# Altium project UD-CPU_DIN_faceboard.PrjPcb
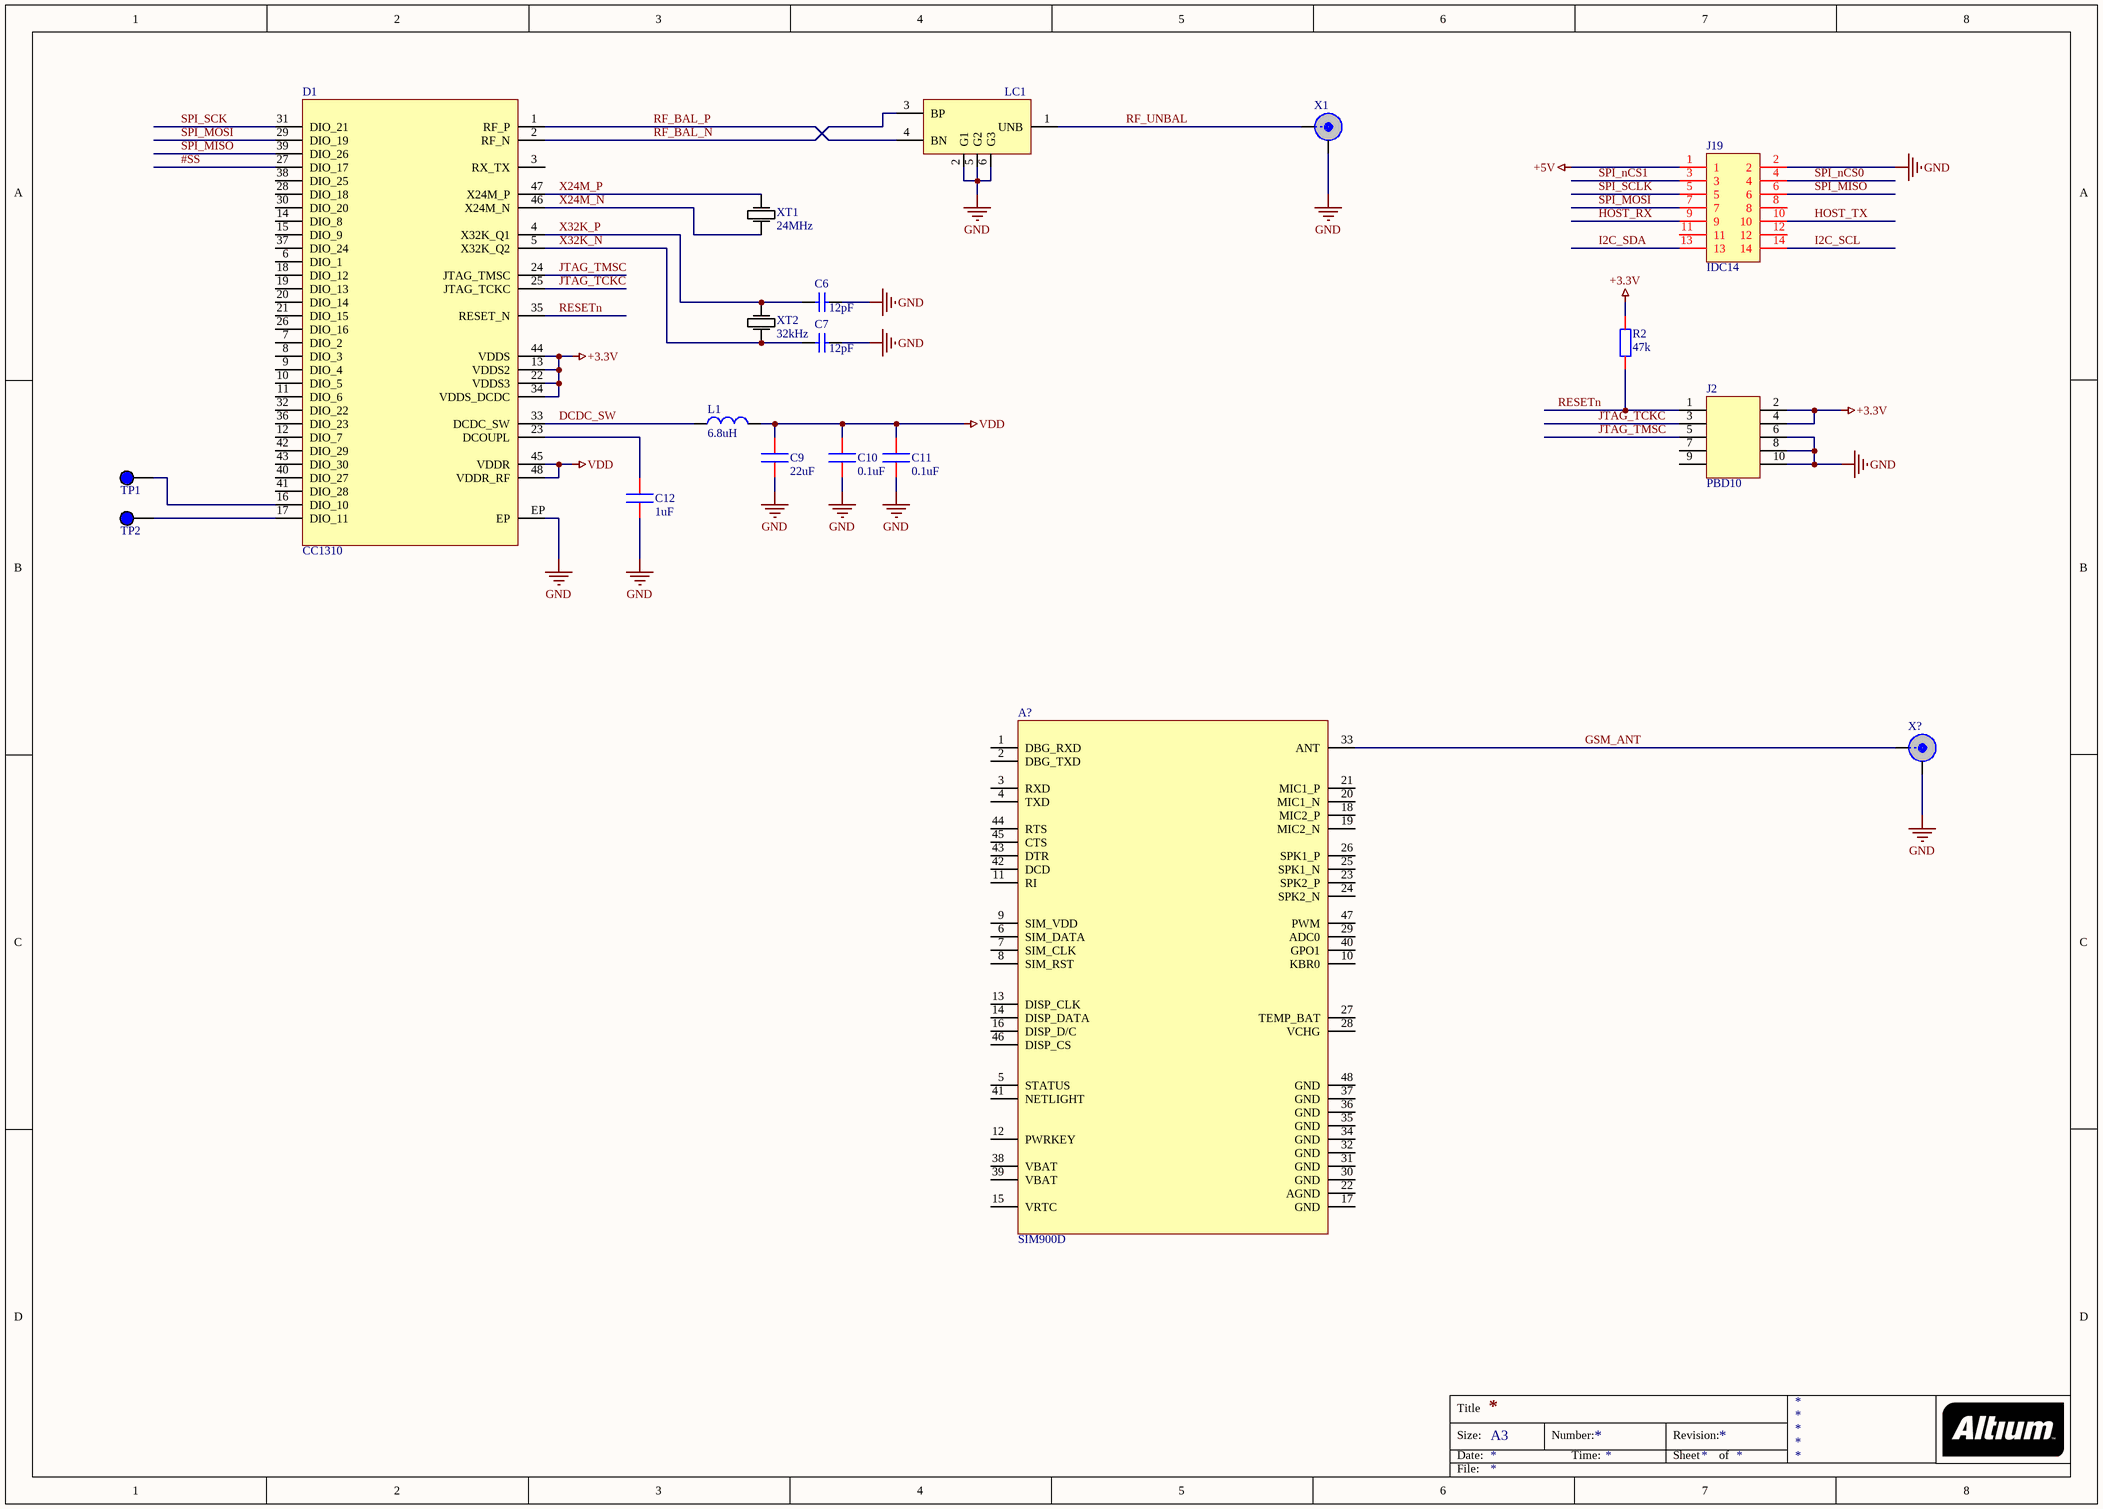
[diagram p0: CPU_DIN_faceboard.SchDoc]
1 sheet, 19 parts. Net scope: global (net labels, ports and power ports of the same name join across sheets).
Board file: CPU_DIN_faceboard_v1_0.PcbDoc

## Sheet CPU_DIN_faceboard.SchDoc
size A3

### Parts
A?  SIM900D  [sim900d]
C6  12pF  [C0603]
C7  12pF  [C0603]
C9  22uF  [C1210]
C10  0.1uF  [C0603]
C11  0.1uF  [C0603]
C12  1uF  [C0603]
D1  CC1310  [TI_RGZ-48]
J2  PBD10  [PBD-10]
J19  IDC14  [IDC14]
L1  6.8uH  [L0603]
LC1  RF_BALUN  [Balun_0433BM15A0001]  (value not drawn)
R2  47k  [R0603]
TP1  TESTPOINT  [testpad]  (value not drawn)
TP2  TESTPOINT  [testpad]  (value not drawn)
X1  SMA coax. connector  [SMA-jr]  (value not drawn)
X?  SMA coax. connector  [SMA-jr]  (value not drawn)
XT1  24MHz  [HC-49U/S]
XT2  32kHz  [XTAL_d2x6mm]

### Nets
+3.3V: D1.13(VDDS2) D1.22(VDDS3) D1.34(VDDS_DCDC) D1.44(VDDS) J2.2 J2.4 R2.2
+5V: J19.1
GND: C6.2 C7.2 C9.1 C10.1 C11.1 C12.2 D1.EP J2.6 J2.8 J2.10 J19.2 LC1.2(G1) LC1.5(G2) LC1.6(G3) X1.SH X?.SH
VDD: C9.2 C10.2 C11.2 D1.45(VDDR) D1.48(VDDR_RF) L1.2
#SS: D1.27(DIO_17)
DCDC_SW: D1.33(DCDC_SW) L1.1
GSM_ANT: A?.33(ANT) X?.I
HOST_RX: J19.9
HOST_TX: J19.10
I2C_SCL: J19.14
I2C_SDA: J19.13
JTAG_TCKC: D1.25(JTAG_TCKC) J2.3
JTAG_TMSC: D1.24(JTAG_TMSC) J2.5
RESETn: D1.35(RESET_N) J2.1 R2.1
RF_BAL_N: D1.2(RF_N) LC1.3(BP)
RF_BAL_P: D1.1(RF_P) LC1.4(BN)
RF_UNBAL: LC1.1(UNB) X1.I
SPI_MISO: D1.39(DIO_26) J19.6
SPI_MOSI: D1.29(DIO_19) J19.7
SPI_nCS0: J19.4
SPI_nCS1: J19.3
SPI_SCK: D1.31(DIO_21)
SPI_SCLK: J19.5
X24M_N: D1.46(X24M_N) XT1.1
X24M_P: D1.47(X24M_P) XT1.2
X32K_N: C7.1 D1.5(X32K_Q2) XT2.2
X32K_P: C6.1 D1.4(X32K_Q1) XT2.1
NetC12_1: C12.1 D1.23(DCOUPL)
NetD1_16: D1.16(DIO_10) TP1.1
NetD1_17: D1.17(DIO_11) TP2.1

Not connected (* = marked no-connect by the designer): A? 1(DBG_RXD) 2(DBG_TXD) 3(RXD) 4(TXD) 5(STATUS) 6(SIM_DATA) 7(SIM_CLK) 8(SIM_RST) 9(SIM_VDD) 10(KBR0) 11(RI) 12(PWRKEY) 13(DISP_CLK) 14(DISP_DATA) 15(VRTC) 16(DISP_D/C) 17(GND) 18(MIC2_P) 19(MIC2_N) 20(MIC1_N) 21(MIC1_P) 22(AGND) 23(SPK2_P) 24(SPK2_N) 25(SPK1_N) 26(SPK1_P) 27(TEMP_BAT) 28(VCHG) 29(ADC0) 30(GND) 31(GND) 32(GND) 34(GND) 35(GND) 36(GND) 37(GND) 38(VBAT) 39(VBAT) 40(GPO1) 41(NETLIGHT) 42(DCD) 43(DTR) 44(RTS) 45(CTS) 46(DISP_CS) 47(PWM) 48(GND); D1 3(RX_TX) 6(DIO_1) 7(DIO_2) 8(DIO_3) 9(DIO_4) 10(DIO_5) 11(DIO_6) 12(DIO_7) 14(DIO_8) 15(DIO_9) 18(DIO_12) 19(DIO_13) 20(DIO_14) 21(DIO_15) 26(DIO_16) 28(DIO_18) 30(DIO_20) 32(DIO_22) 36(DIO_23) 37(DIO_24) 38(DIO_25) 40(DIO_27) 41(DIO_28) 42(DIO_29) 43(DIO_30); J2 7 9; J19 8 11 12

### Notes on the sheet
- Title
- Size:
- Date:
- A3
- Number:
- Time:
- Revision:
- Sheet
- of
- File:

### Library data of the parts
C6 C7 C9-C12 = CAP_SMD
  C6 C7: value: 12pF
  C9: value: 22uF
  C10 C11: value: 0.1uF
  C12: value: 1uF
D1 = CC1310F128RGZ
L1 = Inductor: Magnetic-Core Inductor; partnum: LQG18HN6N8J00; value: 6.8uH
LC1 = RF_BALUN: partnum: 0433BM15A0001E; value: 433MHz
R2 = RES_SMD: value: 47k
X1 X? = SMA-J
XT1 XT2 = XTAL
  XT1: value: 24MHz
  XT2: value: 32kHz